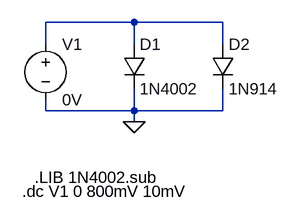
[diagram p0: schematic PreLab1.asc]
PreLab1.asc, the LTspice schematic file:
Version 4
SHEET 1 880 680
WIRE 208 80 80 80
WIRE 336 80 208 80
WIRE 80 112 80 80
WIRE 208 112 208 80
WIRE 336 112 336 80
WIRE 80 208 80 192
WIRE 208 208 208 176
WIRE 208 208 80 208
WIRE 336 208 336 176
WIRE 336 208 208 208
WIRE 208 224 208 208
FLAG 208 224 0
SYMBOL voltage 80 96 R0
WINDOW 123 0 0 Left 0
WINDOW 39 0 0 Left 0
SYMATTR InstName V1
SYMATTR Value 0V
SYMBOL diode 192 112 R0
SYMATTR InstName D1
SYMATTR Value 1N4002
SYMBOL diode 320 112 R0
SYMATTR InstName D2
SYMATTR Value 1N914
TEXT 64 304 Left 2 !.LIB 1N4002.sub
TEXT 46 324 Left 2 !.dc V1 0 800mV 10mV

The netlist it stands for:
* PreLab1.asc
V1 N001 0 0V
D1 N001 0 1N4002
D2 N001 0 1N914
.model D D
.lib standard.dio
.LIB 1N4002.sub
.dc V1 0 800mV 10mV
.backanno
.end